# EasyEDA schematic Schematic.json
TITLE: FilaWinder; REV: 1.0; Date: 2020-09-29; Sheet: 1/1; Company: N/A
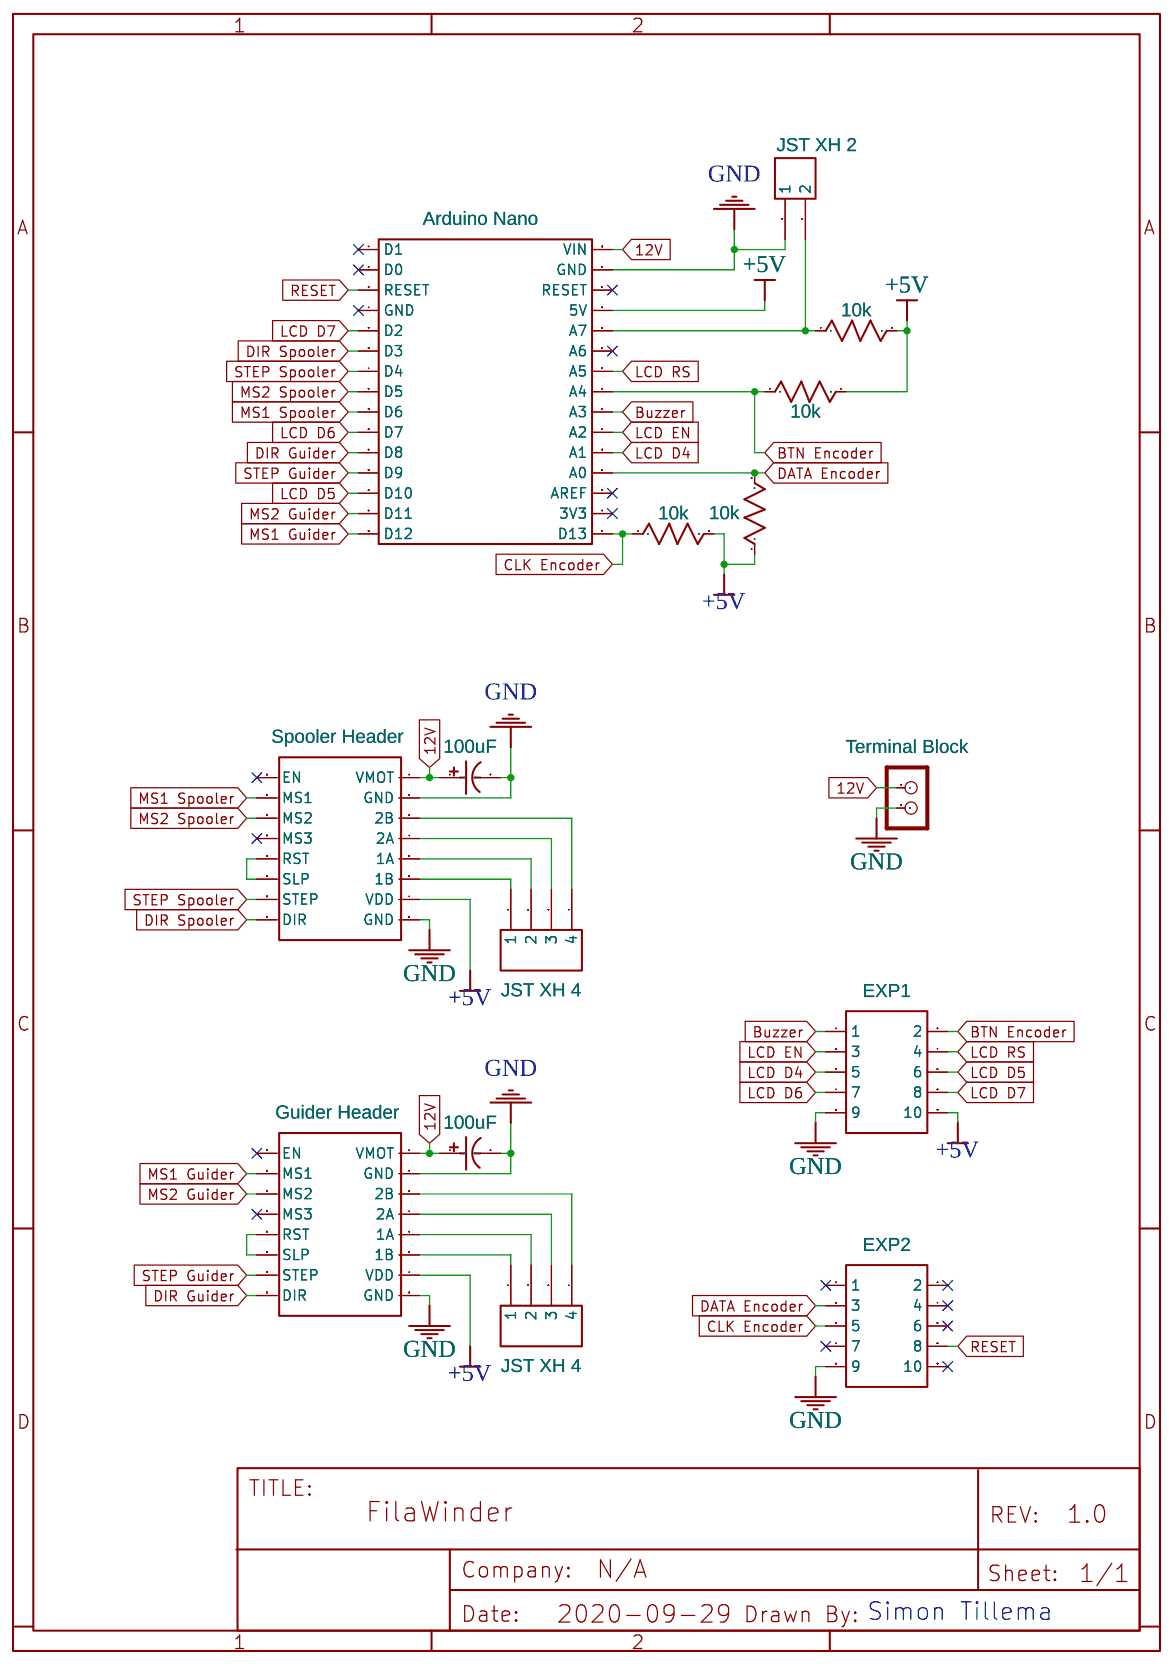
[diagram p0: schematic sheet]

## Parts
C1  100uF  [CAP-TH_BD8.0-P3.50-D1.0-FD]
C3  100uF  [CAP-TH_BD8.0-P3.50-D1.0-FD]
CN1  JST XH 4  [CONN-TH_4P-P2.50_XH-4A]
CN2  JST XH 4  [CONN-TH_4P-P2.50_XH-4A]
CN3  JST XH 2  [CONN-TH_XH-2A]
J1  Arduino Nano  [DIP-30_L43.18-W15.24-ARDUINONANO]
J2  Terminal Block  [TERMINAL_BLOCK_2P_5]
R1  10k  [R0603]
R2  10k  [R0603]
R3  10k  [R0603]
R5  10k  [R0603]
U1  Spooler Header  [A4988 BOARD]
U2  Guider Header  [A4988 BOARD]
U3  EXP1  [10PIN HEADER]
U4  EXP2  [10PIN HEADER]

## Library data of the parts
C1 C3 = 100uF 25V: Supplier: LCSC; Manufacturer: ReliaPro; Supplier Part: C13376
CN1 CN2 = XH-4A: Supplier: LCSC; Manufacturer: BOOMELE; image: //image.lceda.cn/szlcsc/C37815.jpg; Supplier Part: C37815
CN3 = XH-2A: Supplier: LCSC; Manufacturer: BOOMELE; image: //image.lceda.cn/szlcsc/C20079.jpg; Supplier Part: C20079
J1 = Arduino_Nano_Header
J2 = CON_TERMINAL_BLOCK_02-5MM: 2 poles wire to board terminal block; Contributor: DangerousPrototype
R1-R3 R5 = R_0603_US: Contributor: LCEDA_Lib
U1 U2 = A4988 Board: Manufacturer Part: A4988 Stepper Motor Driver Carrier; Supplier Part: 1182; Supplier: Pololu; link: https://www.pololu.com/product/1182; Contributor: s1atbewie.de
U3 U4 = 10pin header: Contributor: auyeungkl999

## Nets
12V: C1.1 C3.1 J1.30(VIN) J2.1 U1.1(VMOT) U2.1(VMOT)
+5V: J1.27(5V) R1.1 R2.2 R3.2 R5.2 U1.7(VDD) U2.7(VDD) U3.10
GND: C1.2 C3.2 CN3.1 J1.29(GND) J2.2 U1.2(GND) U1.8(GND) U2.2(GND) U2.8(GND) U3.9 U4.9
BTN Encoder: J1.23(A4) R3.1 U3.2
Buzzer: J1.22(A3) U3.1
CLK Encoder: J1.16(D13) R2.1 U4.5
DATA Encoder: J1.19(A0) R1.2 U4.3
DIR Guider: J1.11(D8) U2.16(DIR)
DIR Spooler: J1.6(D3) U1.16(DIR)
LCD D4: J1.20(A1) U3.5
LCD D5: J1.13(D10) U3.6
LCD D6: J1.10(D7) U3.7
LCD D7: J1.5(D2) U3.8
LCD EN: J1.21(A2) U3.3
LCD RS: J1.24(A5) U3.4
MS1 Guider: J1.15(D12) U2.10(MS1)
MS1 Spooler: J1.9(D6) U1.10(MS1)
MS2 Guider: J1.14(D11) U2.11(MS2)
MS2 Spooler: J1.8(D5) U1.11(MS2)
RESET: J1.3(RESET) U4.8
STEP Guider: J1.12(D9) U2.15(STEP)
STEP Spooler: J1.7(D4) U1.15(STEP)
Net-(CN1-1): CN1.1 U2.6(1B)
Net-(CN1-2): CN1.2 U2.5(1A)
Net-(CN1-3): CN1.3 U2.4(2A)
Net-(CN1-4): CN1.4 U2.3(2B)
Net-(CN2-1): CN2.1 U1.6(1B)
Net-(CN2-2): CN2.2 U1.5(1A)
Net-(CN2-3): CN2.3 U1.4(2A)
Net-(CN2-4): CN2.4 U1.3(2B)
Net-(CN3-2): CN3.2 J1.26(A7) R5.1
Net-(U1-13): U1.13(RST) U1.14(SLP)
Net-(U2-13): U2.13(RST) U2.14(SLP)

Not connected (* = marked no-connect by the designer): J1 1(D1)* 2(D0)* 4(GND)* 17(3V3)* 18(AREF)* 25(A6)* 28(RESET)*; U1 9(EN)* 12(MS3)*; U2 9(EN)* 12(MS3)*; U4 1* 2* 4* 6* 7* 10*

## Notes on the sheet
- Simon Tillema
